# Altium schematic sheet top.SchDoc
size A4
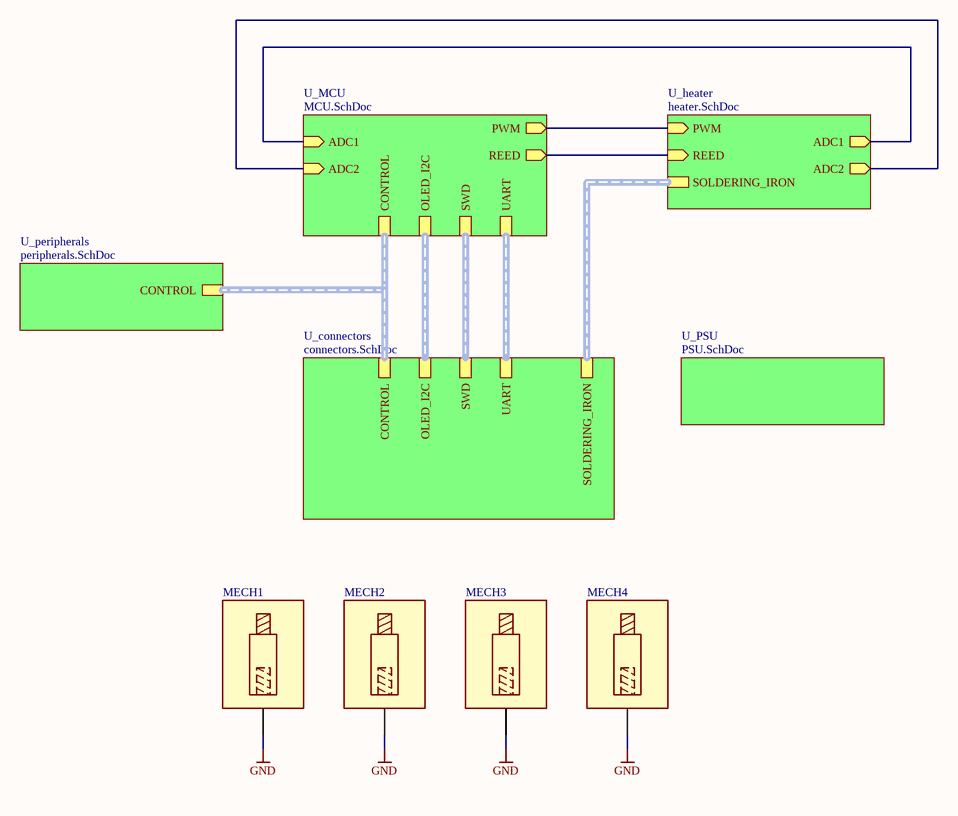
[diagram p0: top.SchDoc]

## Parts
MECH1  M3X0.5  [MECH_SPACER_MALE_FEMALE_18MM_M3]  (value not drawn)
MECH2  M3X0.5  [MECH_SPACER_MALE_FEMALE_18MM_M3]  (value not drawn)
MECH3  M3X0.5  [MECH_SPACER_MALE_FEMALE_18MM_M3]  (value not drawn)
MECH4  M3X0.5  [MECH_SPACER_MALE_FEMALE_18MM_M3]  (value not drawn)

## Sub-sheets
U_connectors = connectors.SchDoc: SWD (harness SWD), CONTROL (harness CONTROL), OLED_I2C (harness OLED_I2C), UART (harness UART), SOLDERING_IRON (harness SOLDERING_IRON)
U_heater = heater.SchDoc: PWM (in), ADC2 (out), ADC1 (out), SOLDERING_IRON (harness SOLDERING_IRON), REED (in)
U_MCU = MCU.SchDoc: SWD (harness SWD), PWM (out), CONTROL (harness CONTROL), OLED_I2C (harness OLED_I2C), UART (harness UART), ADC2 (in), ADC1 (in), REED (out)
U_peripherals = peripherals.SchDoc: CONTROL (harness CONTROL)
U_PSU = PSU.SchDoc: no entries

## Nets
GND: MECH1.1 MECH2.1 MECH3.1 MECH4.1
(unnamed): sheet U_MCU/PWM, sheet U_heater/PWM
(unnamed): sheet U_MCU/ADC2, sheet U_heater/ADC2
(unnamed): sheet U_MCU/ADC1, sheet U_heater/ADC1
(unnamed): sheet U_MCU/REED, sheet U_heater/REED

## Buses and harness runs
harness sheet U_connectors/CONTROL = sheet U_MCU/CONTROL = sheet U_peripherals/CONTROL
harness sheet U_connectors/OLED_I2C = sheet U_MCU/OLED_I2C
harness sheet U_connectors/SOLDERING_IRON = sheet U_heater/SOLDERING_IRON
harness sheet U_connectors/SWD = sheet U_MCU/SWD
harness sheet U_connectors/UART = sheet U_MCU/UART

## Library data of the parts
MECH1-MECH4 = MECH_SPACER_MALE_FEMALE_18MM_M3: Manufacturer: FIX&FASTEN; Value: TP-18; SCH_Footprint: M3; Part Number: MECH_SPACER_MALE_FEMALE_18MM_M3; HelpURL: http://www.tme.eu/pl/Document/c63f116060195082d899531b8f30ddf7/TP-10.pdf; Manufacturer Part Number: TP-18; Supplier 1: TME; Supplier Part Number 1: TP-18; Supplier 2: RS Components; Supplier 3: Farnell; Supplier 4: Mouser; Supplier 5: Digi-Key